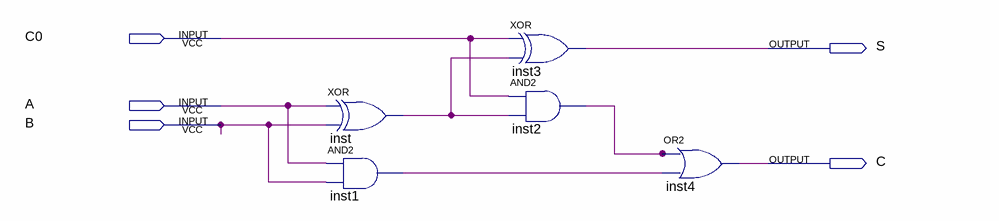
[diagram p0: schematic sheet]
// Quartus schematic fullAdd.bdf as structural Verilog: 5 symbols, 5 pins
module fullAdd (
  input  C0,
  input  A,
  input  B,
  output S,
  output C
);

  wire inst1_out, inst2_out, inst_out;

  xor inst (inst_out, A, B);
  and inst1 (inst1_out, A, B);
  xor inst3 (S, C0, inst_out);
  and inst2 (inst2_out, C0, inst_out);
  or inst4 (C, inst2_out, inst1_out);
endmodule
